# Altium schematic sheet power-input.SchDoc
size A4
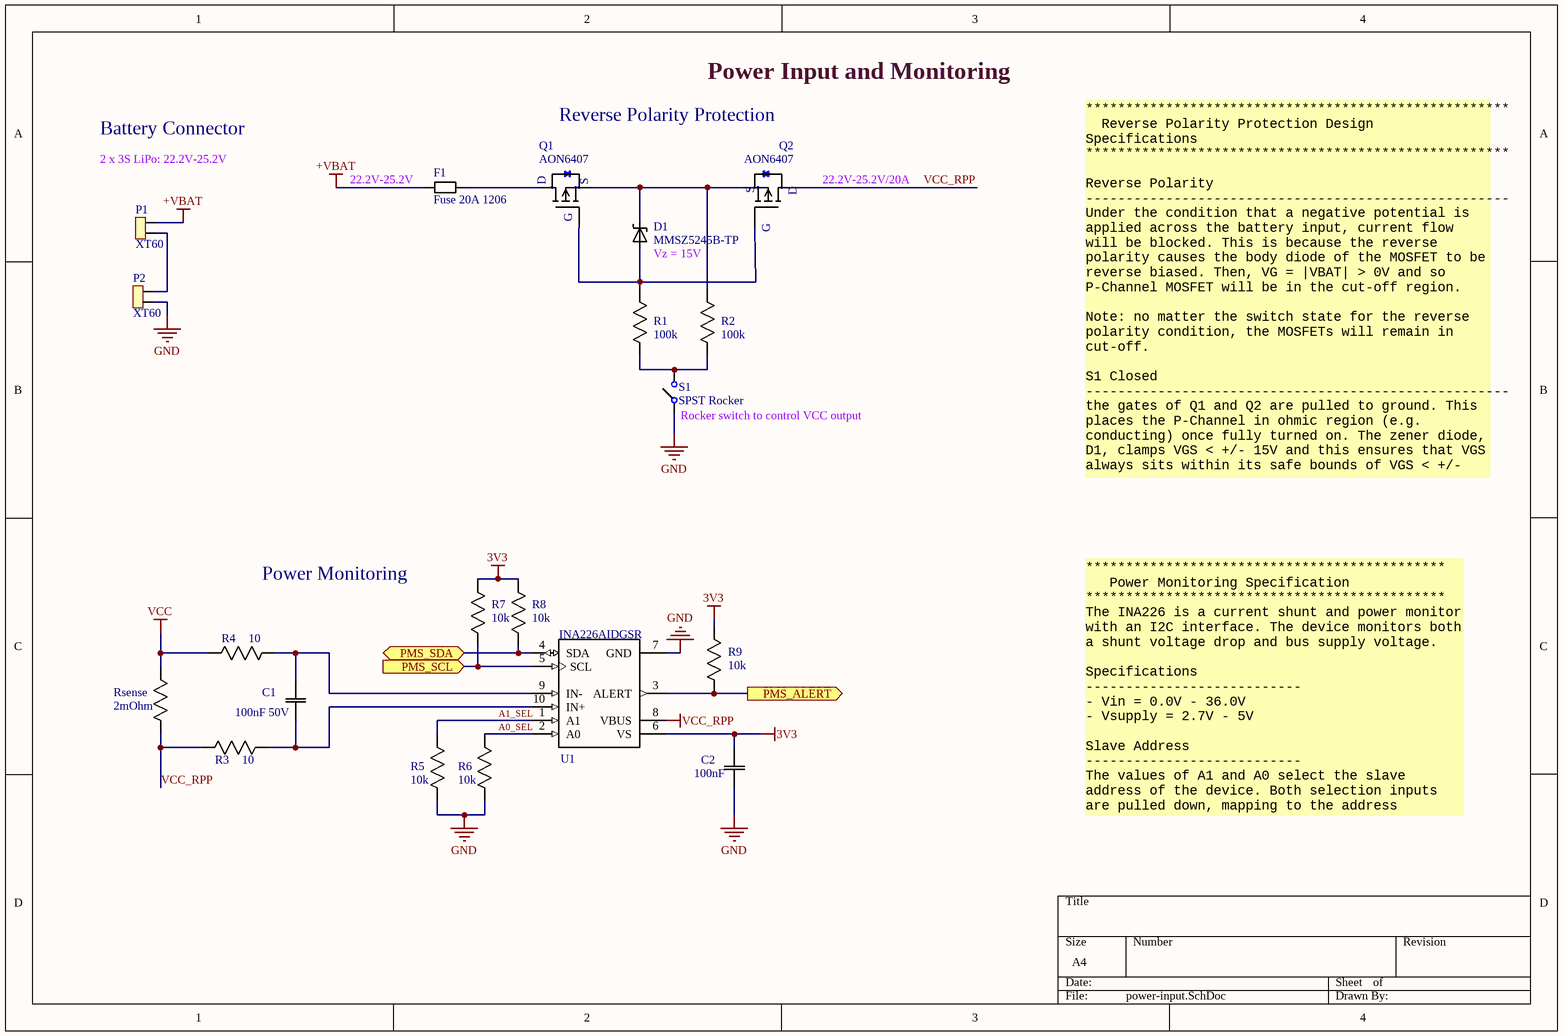
[diagram p0: power-input.SchDoc]

## Parts
C1  100nF 50V  [0805]
C2  100nF  [0805]
D1  MMSZ5245B-TP  [SOD-123]
F1  Fuse 20A 1206  [1206]
P1  XT60  [XT60Connector]
P2  XT60  [XT60Connector]
Q1  AON6407  [8-PowerSMD]
Q2  AON6407  [8-PowerSMD]
R1  100k  [0805]
R2  100k  [0805]
R3  10  [0805]
R4  10  [0805]
R5  10k  [0805]
R6  10k  [0805]
R7  10k  [0805]
R8  10k  [0805]
R9  10k  [0805]
Rsense  2mOhm  [1206]
S1  SPST Rocker  [SWITCH ROCKER SPST 10A 125V]
U1  INA226AIDGSR  [10-VSSOP]

## Ports
PMS_ALERT (out), PMS_SCL (in), PMS_SDA (bidir)

## Nets
3V3: C2.2(C2) R7.1(R1) R8.1(R1) R9.1(R1) U1.6(VS)
+VBAT: F1.1 P1.2
GND: C2.1(C1) P2.1 R5.2(R2) R6.2(R2) S1.0 U1.7(GND)
VCC: R4.2(R2) Rsense.1(R1)
VCC_RPP: Q2.D R3.2(R2) Rsense.2(R2) U1.8(VBUS)
A0_SEL: R6.1(R1) U1.2(A0)
A1_SEL: R5.1(R1) U1.1(A1)
PMS_ALERT: R9.2(R2) U1.3(ALERT) ; port PMS_ALERT
PMS_SCL: R7.2(R2) U1.5(SCL) ; port PMS_SCL
PMS_SDA: R8.2(R2) U1.4(SDA) ; port PMS_SDA
NetC1_1: C1.1(C1) R3.1(R1) U1.10(IN+)
NetC1_2: C1.2(C2) R4.1(R1) U1.9(IN-)
NetD1_A: D1.A Q1.G Q2.G R1.1(R1)
NetD1_C: D1.C Q1.S Q2.S R2.1(R1)
NetF1_2: F1.2 Q1.D
NetP1_1: P1.1 P2.2
NetR1_2: R1.2(R2) R2.2(R2) S1.1

## Notes on the sheet
- Power Input and Monitoring
- Battery Connector
- 2 x 3S LiPo: 22.2V-25.2V
- Reverse Polarity Protection
- (near F1) 22.2V-25.2V
- (near Q2) 22.2V-25.2V/20A
- (near D1) Vz = 15V
- (near S1) Rocker switch to control VCC output
- *****************************************************
  Reverse Polarity Protection Design Specifications
  *****************************************************
  Reverse Polarity
  -----------------------------------------------------
  Under the condition that a negative potential is applied across the battery input, current flow will be blocked. This is because the reverse polarity causes the body diode of the MOSFET to be reverse biased. Then, VG = |VBAT| > 0V and so P-Channel MOSFET will be in the cut-off region.
  Note: no matter the switch state for the reverse polarity condition, the MOSFETs will remain in cut-off.
  S1 Closed
  -----------------------------------------------------
  the gates of Q1 and Q2 are pulled to ground. This places the P-Channel in ohmic region (e.g. conducting) once fully turned on. The zener diode, D1, clamps VGS < +/- 15V and this ensures that VGS always sits within its safe bounds of VGS < +/- 25V.
- Power Monitoring
- *********************************************
  Power Monitoring Specification
  *********************************************
  The INA226 is a current shunt and power monitor
  with an I2C interface. The device monitors both a shunt voltage drop and bus supply voltage.
  Specifications
  ---------------------------
  - Vin = 0.0V - 36.0V
  - Vsupply = 2.7V - 5V
  Slave Address
  ---------------------------
  The values of A1 and A0 select the slave address of the device. Both selection inputs are pulled down, mapping to the address 1000000.

## Library data of the parts
C1 C2 = CAP 100nF 0805: CAP CER 0.1UF 50V X7R 0805; MP: CC0805KRX7R9BB104; MF: Yageo; Tolerance: 10%; Package: 0805; Price: 0,119 CAD; Value: 100nF; Digikey: 311-1140-1-ND; Digikey Link: https://www.digikey.ca/products/en?keywords=311-1140-1-ND; Rating: 50V
D1 = MMSZ5245B-TP: Zener Diode 15V 500mW ±5% Surface Mount SOD-123; MP: MMSZ5224BT1G; MF: ON Semiconductor; Price: None; SnapEDA_Link: https://www.snapeda.com/parts/MMSZ5224BT1G/ON%20Semiconductor/view-part/230941/?ref=snap; Package: SOD-123 ON Semiconductor; Availability: Unavailable; Value: *; ComponentLink1Description: digikey; ComponentLink1URL: https://www.digikey.ca/en/products/detail/micro-commercial-co/MMSZ5245B-TP/1793206
F1 = Fuse 20A 1206: FUSE BOARD MOUNT 20A 32VAC 63VDC; MF: Schurter Inc.; MP: 3413.0331.22; Digikey: 486-1689-6-ND; Rating: 20A; Digikey Link: https://www.digikey.ca/product-detail/en/schurter-inc/3413.0331.22/486-1689-6-ND/2870024
P1 P2 = XT60 Connector: XT60 CONNECTORS FEMALE PAIR; MF: SparkFun Electronics; MP: PRT-10474; Digikey: 1568-1816-ND; Digikey Link: https://www.digikey.ca/product-detail/en/sparkfun-electronics/PRT-10474/1568-1816-ND/8258064; Package: XT60; Price: 2.13000 CAD; Value: N/A
Q1 Q2 = AON6407: P-Channel 30V 32A (Ta), 85A (Tc) 7.3W (Ta), 83W (Tc) Surface Mount 8-DFN (5x6); MF: Alpha & Omega Semiconductor Inc.; Package: 8-PowerSMD; MP: AON6407; Digikey: 785-1421-1-ND; Digikey Link: https://www.digikey.ca/product-detail/en/alpha-omega-semiconductor-inc/AON6407/785-1421-1-ND/3466800
R1 R2 = RES 100k 0805: RES SMD 100K OHM 1% 1/8W 0805; MP: RC0805FR-07100KL; MF: Yageo; Rating: 0.125W; Digikey: 311-100KCRCT-ND; Price: 0.058 CAD; Package: 0805; Value: 100k; Digikey Link: https://www.digikey.ca/products/en?keywords=311-100KCRCT-ND; Tolerance: 1%
R3 R4 = RES 10 0805: RES SMD 10 OHM 1% 1/8W 0805; MP: RC0805FR-0710RL; MF: Yageo; Rating: 0.125W; Digikey: 311-10.0CRCT-ND; Price: 0.15 CAD; Package: 0805; Value: 10; Digikey Link: https://www.digikey.ca/product-detail/en/yageo/RC0805FR-0710RL/311-10.0CRCT-ND/730481; Tolerance: 1%
R5 R6 = RES 10k 1/8W: RES SMD 10K OHM 1% 1/8W 0805; Power (Watts): 0.125W; Package: 0805; Value: 10k; Tolerance: 1%
R7-R9 = RES 10k 0805: RES SMD 10K OHM 1% 1/8W 0805; MP: RC0805FR-0710KL; MF: Yageo; Rating: 0.125W; Digikey: 311-10.0KCRCT-ND; Price: 0.061 CAD; Package: 0805; Value: 10k; Digikey Link: https://www.digikey.ca/products/en?keywords=311-10.0KCRCT-ND; Tolerance: 1%
Rsense = RES 2mOhm 1206: RES 0.002 OHM 1% 1W 1206; MP: CSR1206-0R002F1; MF: Riedon; Value: 0.002; Rating: 0.125W; Digikey: 696-1370-1-ND; Price: 0.88 CAD; Package: 1206; Digikey Link: https://www.digikey.ca/product-detail/en/riedon/CSR1206-0R002F1/696-1370-1-ND/2813303
S1 = SWITCH ROCKER SPST 10A 125V: Rocker Switch SPST 10A (AC) 125V Panel Mount, Snap-In; MP: SRB22A2FBBNN; MF: ZF Electronics; Digikey: CH755-ND; Digikey Link: https://www.digikey.ca/product-detail/en/zf-electronics/SRB22A2FBBNN/CH755-ND/446021; Price: 1.276 CAD; Rating: 10A 125V
U1 = INA226AIDGSR: 36-V, Bi-Directional, Ultra-High Accuracy, Low-/High-Side, I2C Out Current/Power Monitor w/ Alert 10-VSSOP -40 to 125; MF: Texas Instruments; Price: None; MP: INA226AIDGSR; SnapEDA_Link: https://www.snapeda.com/parts/INA226AIDGSR/Texas%20Instruments/view-part/53552/?ref=snap; Package: MSOP-10 Texas Instruments; Availability: Unavailable; Value: *; Digikey: 296-29034-2-ND; Digikey Link: https://www.digikey.ca/product-detail/en/texas-instruments/INA226AIDGSR/296-29034-2-ND/2687236